# EAGLE design disp (EAGLE 7.4.0)
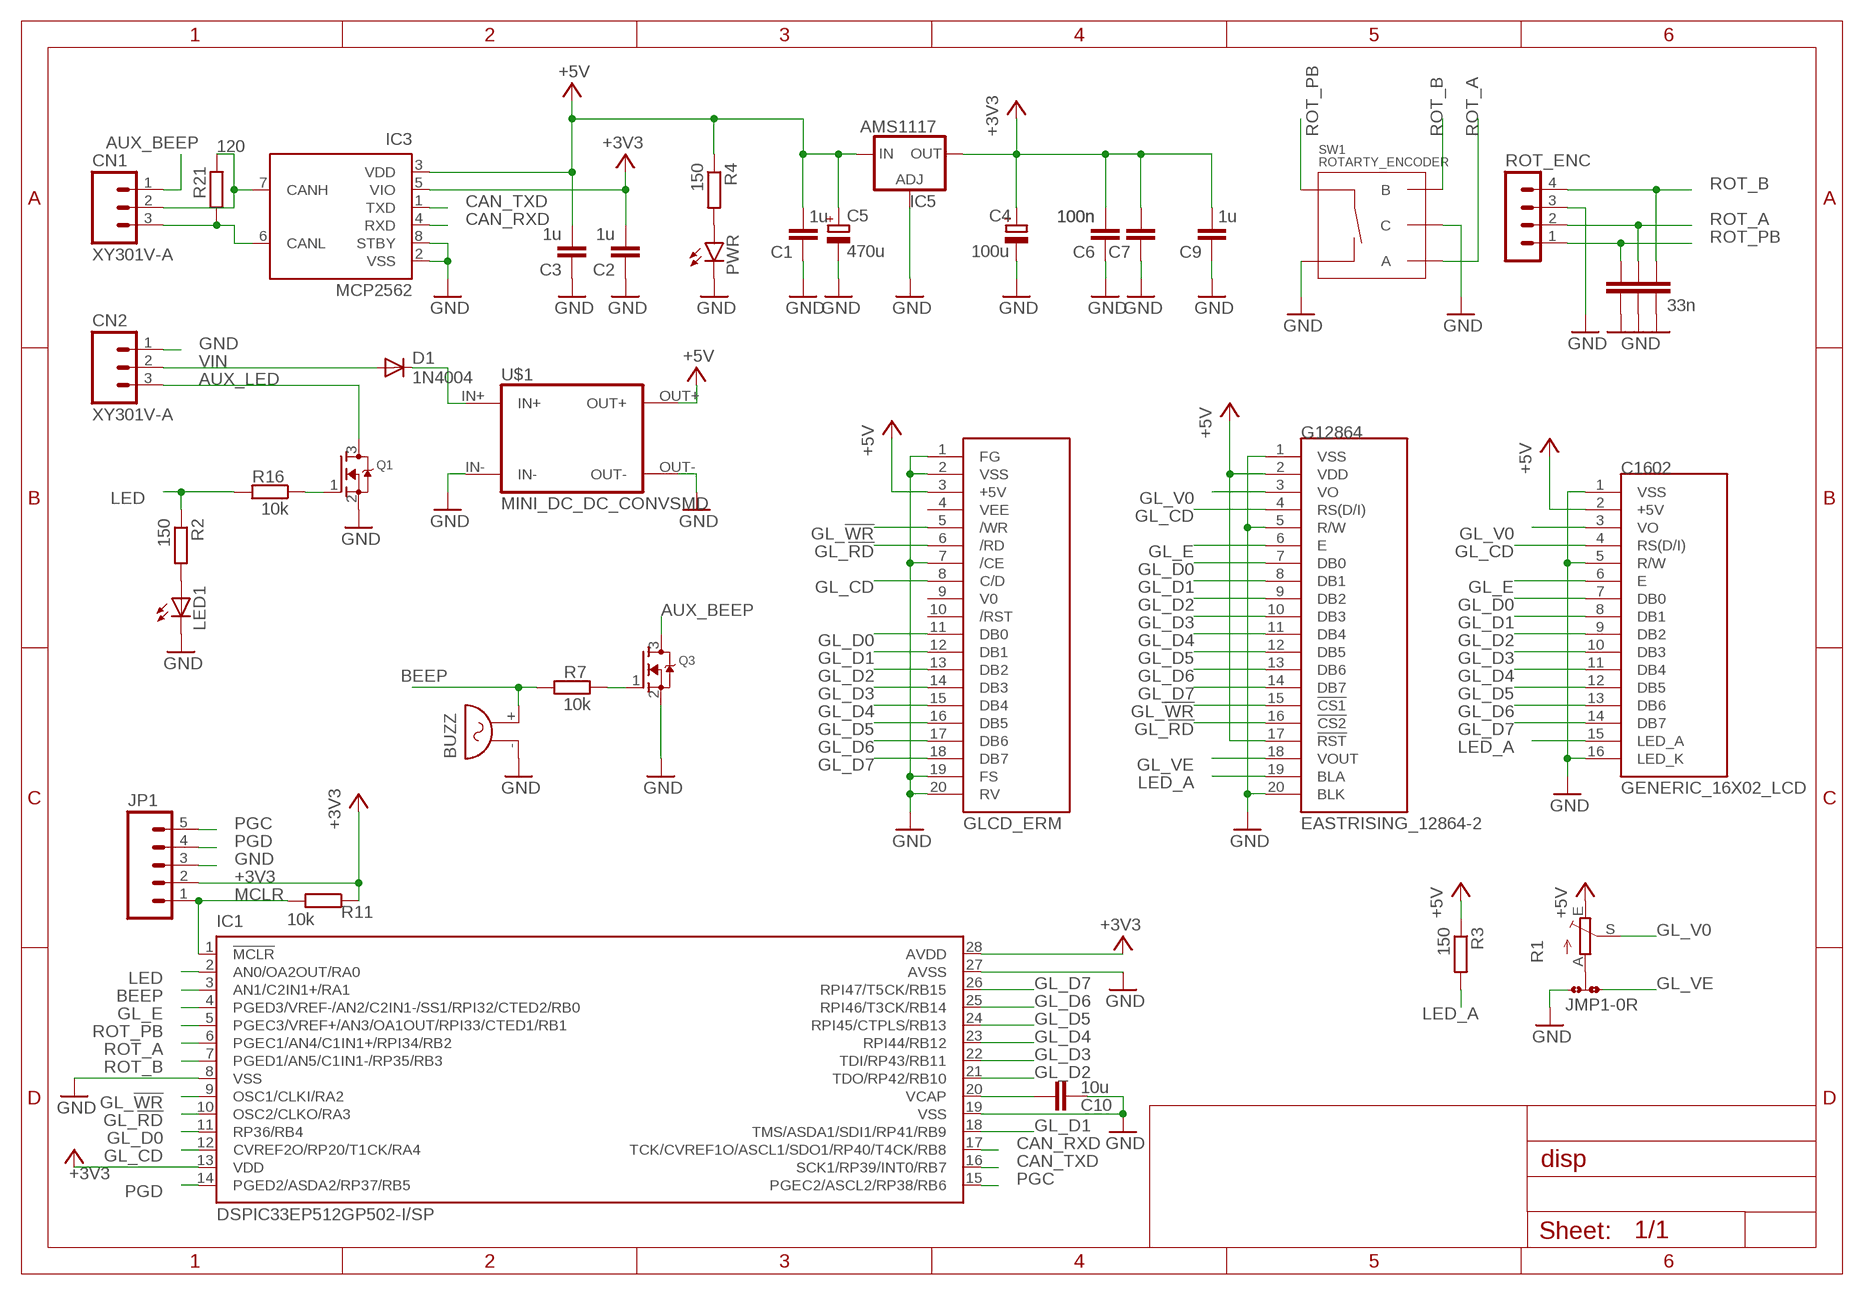
[diagram p0: schematic, sheet 1]

## Parts
BUZZ  F/QMX  [F/QMX]
C1  1u  C-EUC0603K  [C0603K]
C2  1u  C-EUC0603K  [C0603K]
C3  1u  C-EUC0603K  [C0603K]
C4  100u  CPOL-EUE2.5-7  [E2,5-7]
C5  470u  CPOL-EUE3.5-8  [E3,5-8]
C6  100n  C-EUC0603K  [C0603K]
C7  100n  C-EUC0603K  [C0603K]
C9  1u  C-EUC0603K  [C0603K]
C10  10u  C-EU025-030X050  [C025-030X050]
C11  33n  C-EUC0603K  [C0603K]
C12  33n  C-EUC0603K  [C0603K]
C13  33n  C-EUC0603K  [C0603K]
C1602  GENERIC_16X02_LCD  [1X16]
CN1  XY301V-A  [XY301V-A]
CN2  XY301V-A  [XY301V-A]
D1  1N4004  [DO41-10]
G12864  EASTRISING_12864-2  [1X20]
GLCD_ERM  WITSCHI_ERM25664AAG-1  [1X20]
IC1  DSPIC33EP512GP502-I/SP  [DIL28-3]
IC3  MCP2562  MCP2562-E/P  [DIL8]
IC5  AMS1117  LD117AS33TR  [SOT223]
JMP1  0R-JUMPB  [B0R-JMP]
JP1  M05PTH  [1X05]
LED1  LED5MM  [LED5MM]
PWR  LED-FKIT-1206  [FKIT-LED-1206]
Q1  MOSFET-NREFLOW  [SOT23]
Q3  MOSFET-NREFLOW  [SOT23]
R1  TRIM_EU-B64Y  [B64Y]
R2  150  R-EU_R0603  [R0603]
R3  150  R-EU_R0603  [R0603]
R4  150  R-EU_R0603  [R0603]
R7  10k  R-EU_R0603  [R0603]
R11  10k  R-EU_R0603  [R0603]
R16  10k  R-EU_R0603  [R0603]
R21  120  R-EU_R0603  [R0603]
ROT_ENC  MA04-1  [MA04-1]
SW1  ROTARTY_ENCODER  [ROTARY_ENC_PLAIN]
U$1  MINI_DC_DC_CONVSMD  [DSN-MINI-360-SMD]

## Nets
+3V3: C2.2 C4.+ C6.2 C7.2 C9.2 IC1.13(VDD) IC1.28(AVDD) IC3.5(VIO) IC5.2(OUT) IC5.@2(OUT) JP1.2 R11.1
+5V: C1.2 C3.2 C5.+ C1602.2(+5V) G12864.2(VDD) G12864.17(!RST) GLCD_ERM.3(+5V) IC3.3(VDD) IC5.3(IN) R1.E R3.1 R4.1 U$1.OUT+
AUX_BEEP: CN1.1 Q3.3(D)
AUX_LED: CN2.3 Q1.3(D)
BEEP: BUZZ.+ IC1.3(AN1/C2IN1+/RA1) R7.2
CAN_H: CN1.2 IC3.7(CANH) R21.2
CAN_L: CN1.3 IC3.6(CANL) R21.1
CAN_RXD: IC1.17(TCK/CVREF1O/ASCL1/SDO1/RP40/T4CK/RB8) IC3.4(RXD)
CAN_TXD: IC1.16(SCK1/RP39/INT0/RB7) IC3.1(TXD)
GL_!RD: G12864.16(!CS2) GLCD_ERM.6(/RD) IC1.10(OSC2/CLKO/RA3)
GL_!WR: G12864.15(!CS1) GLCD_ERM.5(/WR) IC1.9(OSC1/CLKI/RA2)
GL_CD: C1602.4(RS(D/I)) G12864.4(RS(D/I)) GLCD_ERM.8(C/D) IC1.12(CVREF2O/RP20/T1CK/RA4)
GL_D0: C1602.7(DB0) G12864.7(DB0) GLCD_ERM.11(DB0) IC1.11(RP36/RB4)
GL_D1: C1602.8(DB1) G12864.8(DB1) GLCD_ERM.12(DB1) IC1.18(TMS/ASDA1/SDI1/RP41/RB9)
GL_D2: C1602.9(DB2) G12864.9(DB2) GLCD_ERM.13(DB2) IC1.21(TDO/RP42/RB10)
GL_D3: C1602.10(DB3) G12864.10(DB3) GLCD_ERM.14(DB3) IC1.22(TDI/RP43/RB11)
GL_D4: C1602.11(DB4) G12864.11(DB4) GLCD_ERM.15(DB4) IC1.23(RPI44/RB12)
GL_D5: C1602.12(DB5) G12864.12(DB5) GLCD_ERM.16(DB5) IC1.24(RPI45/CTPLS/RB13)
GL_D6: C1602.13(DB6) G12864.13(DB6) GLCD_ERM.17(DB6) IC1.25(RPI46/T3CK/RB14)
GL_D7: C1602.14(DB7) G12864.14(DB7) GLCD_ERM.18(DB7) IC1.26(RPI47/T5CK/RB15)
GL_E: C1602.6(E) G12864.6(E) IC1.4(PGED3/VREF-/AN2/C2IN1-/SS1/RPI32/CTED2/RB0)
GL_V0: C1602.3(VO) G12864.3(VO) R1.S
GL_VE: G12864.18(VOUT) JMP1.3
GND: BUZZ.- C1.1 C2.1 C3.1 C4.- C5.- C6.1 C7.1 C9.1 C10.1 C11.1 C12.1 C13.1 C1602.1(VSS) C1602.5(R/W) C1602.16(LED_K) CN2.1 G12864.1(VSS) G12864.5(R/W) G12864.20(BLK) GLCD_ERM.1(FG) GLCD_ERM.2(VSS) GLCD_ERM.7(/CE) GLCD_ERM.19(FS) GLCD_ERM.20(RV) IC1.8(VSS) IC1.19(VSS) IC1.27(AVSS) IC3.2(VSS) IC3.8(STBY) IC5.1(ADJ) JMP1.1 JP1.3 LED1.K(C) PWR.C Q1.2(S) Q3.2(S) ROT_ENC.3 SW1.C SW1.SW- U$1.IN- U$1.OUT-
LED: IC1.2(AN0/OA2OUT/RA0) R2.1 R16.2
LED_A: C1602.15(LED_A) G12864.19(BLA) R3.2
MCLR: IC1.1(!MCLR!) JP1.1 R11.2
N$1: Q3.1(G) R7.1
N$2: LED1.A R2.2
N$3: PWR.A R4.2
N$5: JMP1.2 R1.A
N$9: Q1.1(G) R16.1
PGC: IC1.15(PGEC2/ASCL2/RP38/RB6) JP1.5
PGD: IC1.14(PGED2/ASDA2/RP37/RB5) JP1.4
ROT_A: C12.2 IC1.6(PGEC1/AN4/C1IN1+/RPI34/RB2) ROT_ENC.2 SW1.A
ROT_B: C13.2 IC1.7(PGED1/AN5/C1IN1-/RP35/RB3) ROT_ENC.4 SW1.B
ROT_PB: C11.2 IC1.5(PGEC3/VREF+/AN3/OA1OUT/RPI33/CTED1/RB1) ROT_ENC.1 SW1.SW+
VCAP: C10.2 IC1.20(VCAP)
VIN: CN2.2 D1.A
VIN_D: D1.C U$1.IN+
Unconnected: GLCD_ERM.10(/RST)

## Power pins joined to a net without a drawn wire
V0: GLCD_ERM.9(V0)
VEE: GLCD_ERM.4(VEE)

## Library data of the parts
BUZZ = buzzer:F/QMX: BUZZER Source: Buerklin; OC_FARNELL: unknown; OC_NEWARK: unknown
C1-C3 C6 C7 C9-C13 = rcl:C-EU: CAPACITOR, European symbol
C4 C5 = rcl:CPOL-EU: POLARIZED CAPACITOR, European symbol
C1602 = aliexpress_modules:GENERIC_16X02_LCD
CN1 CN2 = aliexpress_modules:XY301V-A: 3 Pin Screw Terminal Block Connector 5mm Pitch 5.08-301-3P 301-3P 3pin
D1 = diode:1N4004: DIODE general purpose rectifier, 1 A
G12864 = aliexpress_modules:EASTRISING_12864-2: 2.9"128x64 Graphic LCD Display Module KS0108 Black on White. http://www.buydisplay.com/default/2-9-inch-128x64-graphic-lcd-display-module-ks0108-black-on-white http://www.buydisplay.com/download/manual/ERM12864-2_Series_Datasheet.pdf
GLCD_ERM = aliexpress_modules:WITSCHI_ERM25664AAG-1: EastRising 256x64 pixel graphic LCD module Blue backlight 184x75x12 mm VR1=10k or 20k pot R18=10k C21=0.1uF Bridge from A to +C1 Bridge from K to GND_Fill
IC1 = microchip:DSPIC33EP512*502: 16-Bit Microcontrollers and Digital Signal Controllers with High-Speed PWM, Op Amps and Advanced Analog Source: ww1.microchip.com/downloads/en/DeviceDoc/70000657H.pdf
IC3 = microchip:MCP2562: High-Speed CAN Transceiver Source: http://ww1.microchip.com/downloads/en/DeviceDoc/20005167C.pdf
IC5 = v-reg:LD117A?*: Low drop fixed and adjustable positive voltage regulators 1 A Source: http://www.st.com/stonline/products/literature/ds/7194/ld1117axx.pdf
JMP1 = jump-0r-smd:0R-JUMP: SMD 0R 0805 Jumper
JP1 = SparkFun-Connectors:M05: Header 5 Standard 5-pin 0.1" header. Use with straight break away headers (SKU : PRT-00116), right angle break away headers (PRT-00553), swiss pins (PRT-00743), machine pins (PRT-00117), and female headers (PRT-00115). Molex polarized connector foot print use with SKU : PRT-08230 with associated crimp pins and housings.
LED1 = adafruit:LED: LED OSRAM: - CHIPLED LG R971, LG N971, LY N971, LG Q971, LY Q971, LO R971, LY R971 LH N974, LH R974 LS Q976, LO Q976, LY Q976 LO Q996 - Hyper CHIPLED LW Q18S LB Q993, LB Q99A, LB R99A - SideLED LS A670, LO A670, LY A670, LG A670, LP A670 LB A673, LV A673, LT A673, LW A673 LH A674 LY A675 LS A676, LA A676, LO A676, LY A676, LW A676 LS A679, LY A679, LG A679 - Hyper Micro SIDELED® LS Y876, LA Y876, LO Y876, LY Y876 LT Y87S - SmartLED LW L88C, LW L88S LB L89C, LB L89S, LG L890 LS L89K, LO L89K, LY L89K LS L896, LA L896, LO L896, LY L896 - TOPLED LS T670, LO T670, LY T670, LG T670, LP T670 LSG T670, LSP T670, LSY T670, LOP T670, LYG T670 LG T671, LOG T671, LSG T671 LB T673, LV T673, LT T673, LW T673 LH T674 LS T676, LA T676, LO T676, LY T676, LB T676, LH T676, LSB T676, LW T676 LB T67C, LV T67C, LT T67C, LS T67K, LO T67K, LY T67K, LW E67C LS E67B, LA E67B, LO E67B, LY E67B, LB E67C, LV E67C, LT E67C LW T67C LS T679, LY T679, LG T679 LS T770, LO T770, LY T770, LG T770, LP T770 LB T773, LV T773, LT T773, LW T773 LH T774 LS E675, LA E675, LY E675, LS T675 LS T776, LA T776, LO T776, LY T776, LB T776 LHGB T686 LT T68C, LB T68C - Hyper Mini TOPLED® LB M676 - Mini TOPLED Santana® LG M470 LS M47K, LO M47K, LY M47K Source: http://www.osram.convergy.de/
PWR = SparkFun-LED:LED: LEDs Standard schematic elements and footprints for 5mm, 3mm, 1206, and 0603 sized LEDs. 5mm - Spark Fun Electronics SKU : COM-00529 (and others)
Q1 Q3 = adafruit:MOSFET-N: N-Channel Mosfet 2N7002E - 60V 260mA SOT23 [Digikey: 2N7002ET1GOSTR-ND] - REEL BSH103 - 30V 850mA SOT23 [Digikey: 568-5013-1-ND]
R1 = pot:TRIM_EU-: POTENTIOMETER
R2-R4 R7 R11 R16 R21 = rcl:R-EU_: RESISTOR, European symbol
ROT_ENC = con-lstb:MA04-1: PIN HEADER; OC_FARNELL: unknown; OC_NEWARK: unknown
SW1 = SparkFun-Electromechanical:ROTARTY_ENCODER: Simple no LED rotary encoder Example: COM-09117
U$1 = aliexpress_modules:MINI_DC_DC_CONV: RC Airplane Module Mini 360 DC Buck Converter Step Down Module 4.75V-23V to 1V-17V 17x11x3.8mm New LM2596; $1.06 Input voltage: 4.75V-23V; Output voltage: 1.0V-17V; Current output: peak 3A, 1.8A long time

## Board
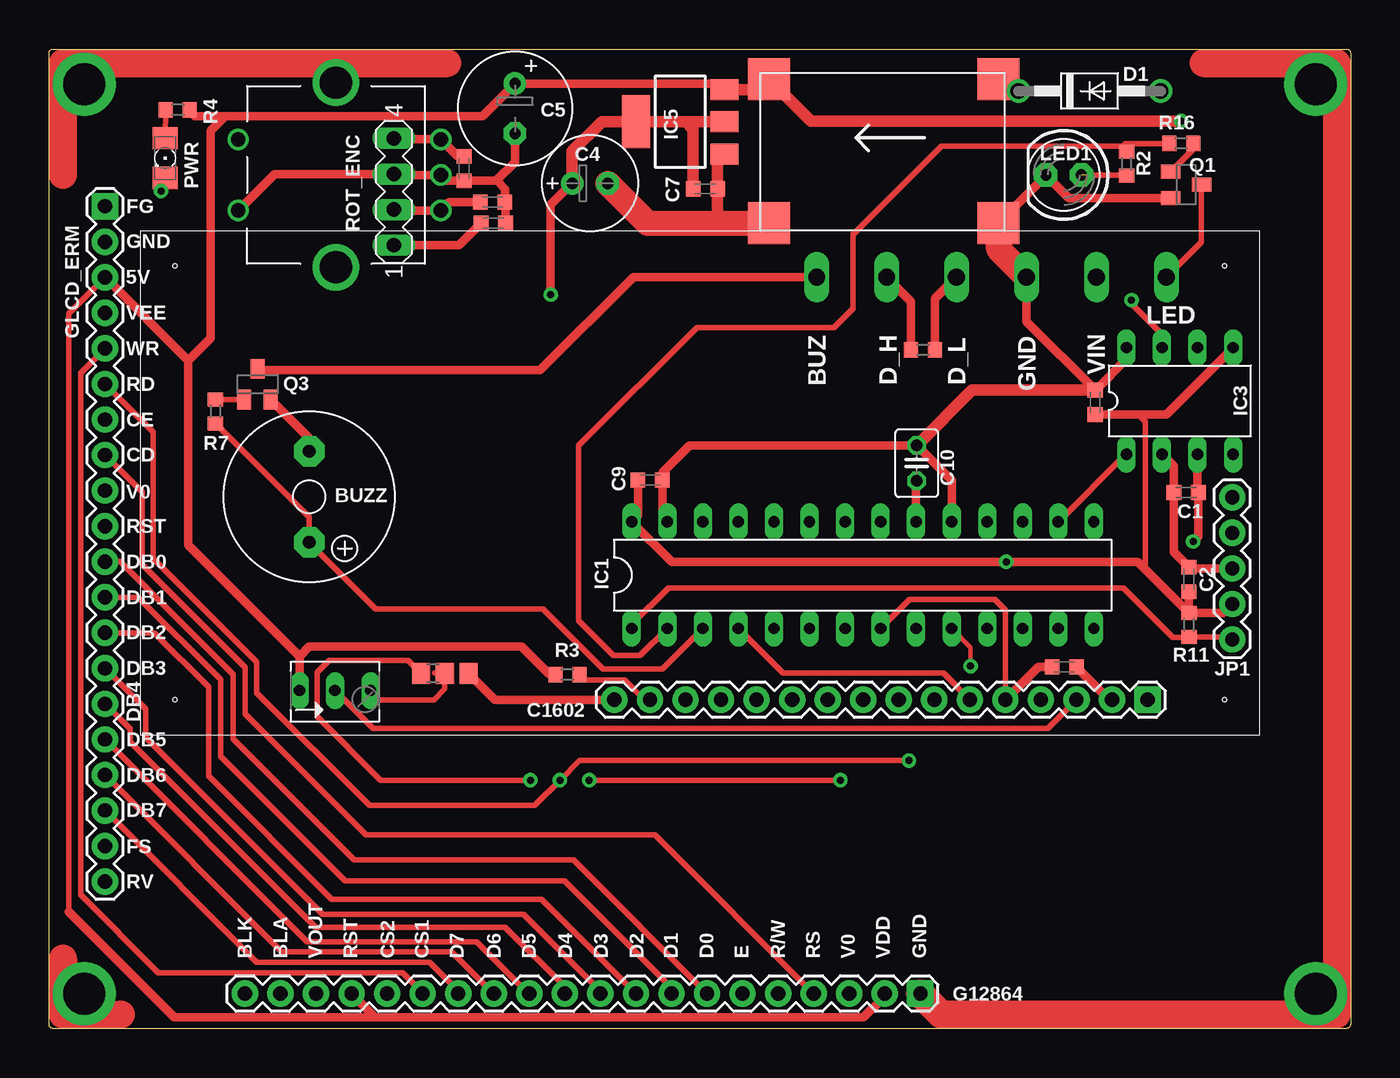
[diagram p1: board, top side]
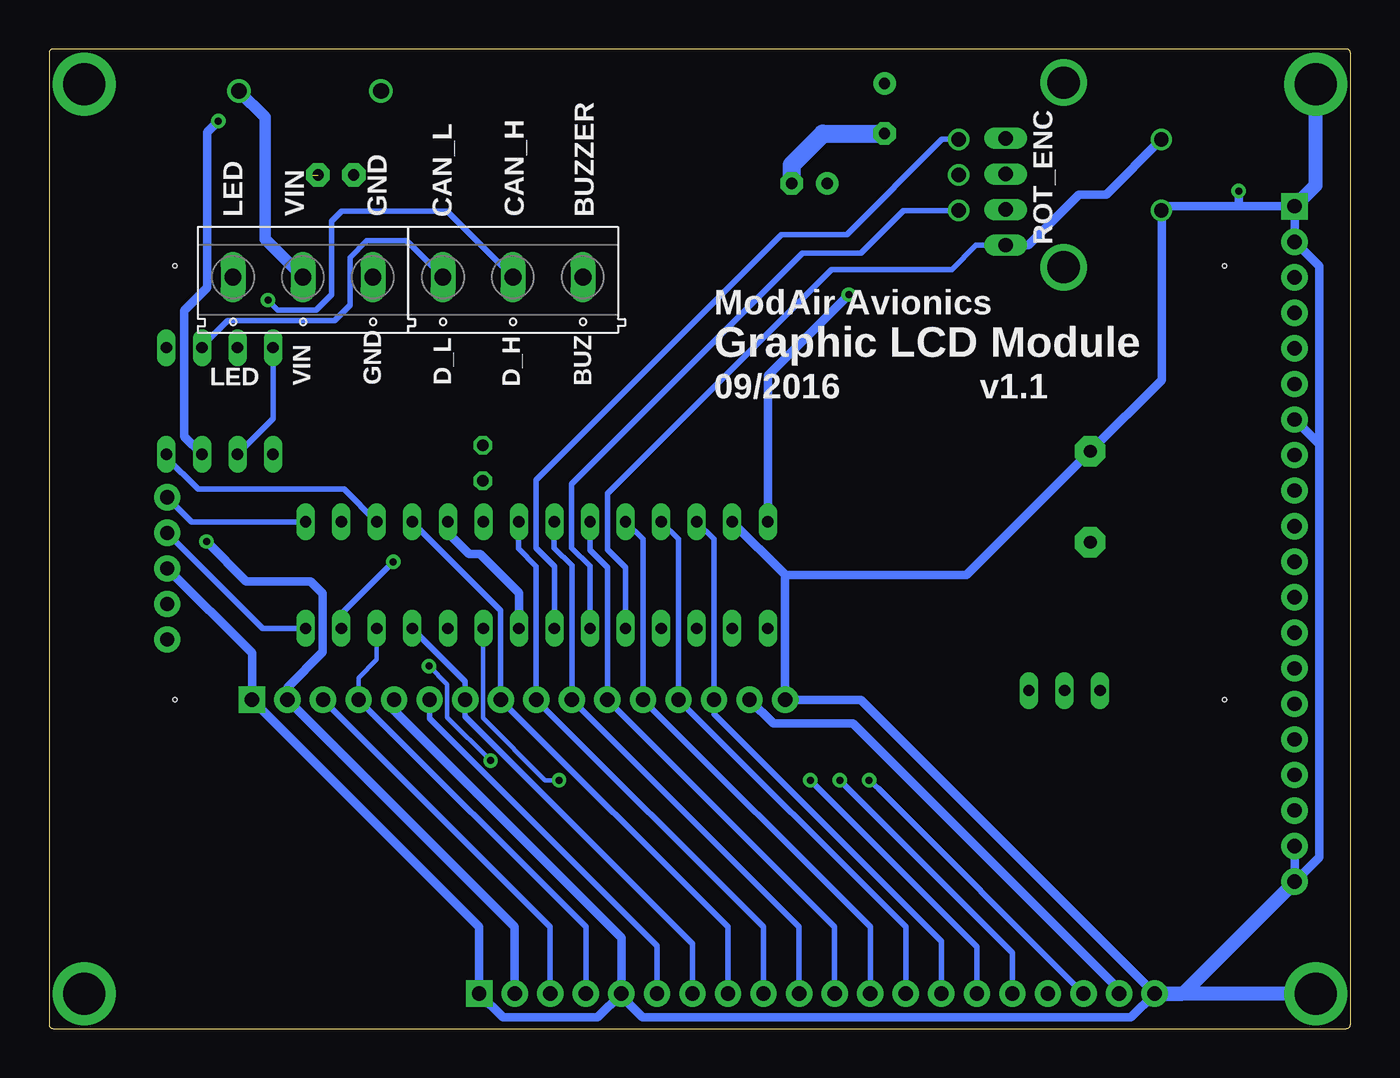
[diagram p2: board, bottom side, seen from below]

Size 93 x 70 mm. Coordinates in mm from the lower left corner, seen from the top.
Outline: 92.7,0 0.3,0 arc-90 0,0.3 0,69.7 arc-90 0.3,70 92.7,70 arc-90 93,69.7 93,0.3 arc-90 92.7,0
Copper layers (1*16): Top 0.035mm / dielectric 1.5mm / Bottom 0.035mm
Design rules "ITEAD_DRU_CHECK": minimum track width 6mil, minimum drill 12mil, track to track 6mil, track to pad 6mil, pad to pad 6mil, via to via 6mil, smd to smd 0mil, copper to edge 10mil, drill to drill 10mil, minimum pad ring 10mil, minimum via ring 6mil, stop-mask expansion 2mil, vias tented up to drill 100mil, thermal gap 10mil
Holes 0.3 mm at 9,54.5 84,54.5 84,23.5 9,23.5

### Footprints (pad centres in the part's own frame; a part is rotated, then mirrored left to right if it is on the bottom)
F/QMX = drill 0.914 pad 2.159 octagon: + 3.251,0; - -3.251,0
C0603K = smd 1.05 x 1.08: 1 -0.875,0; 2 0.875,0
E2,5-7 = drill 0.813 pad 1.6: + -1.27,0 | drill 0.813 pad 1.6 octagon: - 1.27,0
E3,5-8 = drill 0.813 pad 1.6: + -1.778,0 | drill 0.813 pad 1.6 octagon: - 1.778,0
C025-030X050 = drill 0.813 octagon: 1 -1.27,0; 2 1.27,0
1X16 = drill 1.016 pad 1.88 square: 1 0,0 | drill 1.016 pad 1.88: 2 2.54,0; 3 5.08,0; 4 7.62,0; 5 10.16,0; 6 12.7,0; 7 15.24,0; 8 17.78,0; 9 20.32,0; 10 22.86,0; 11 25.4,0; 12 27.94,0; 13 30.48,0; 14 33.02,0; 15 35.56,0; 16 38.1,0
XY301V-A = drill 1.2 long: 1 -5,0; 2 0,0; 3 5,0
DO41-10 = drill 1.118: A 5.08,0; C -5.08,0
1X20 = drill 1.016 pad 1.88 square: 1 0,0 | drill 1.016 pad 1.88: 2 2.54,0; 3 5.08,0; 4 7.62,0; 5 10.16,0; 6 12.7,0; 7 15.24,0; 8 17.78,0; 9 20.32,0; 10 22.86,0; 11 25.4,0; 12 27.94,0; 13 30.48,0; 14 33.02,0; 15 35.56,0; 16 38.1,0; 17 40.64,0; 18 43.18,0; 19 45.72,0; 20 48.26,0
DIL28-3 = drill 0.813 long: 1 -16.51,-3.81; 2 -13.97,-3.81; 3 -11.43,-3.81; 4 -8.89,-3.81; 5 -6.35,-3.81; 6 -3.81,-3.81; 7 -1.27,-3.81; 8 1.27,-3.81; 9 3.81,-3.81; 10 6.35,-3.81; 11 8.89,-3.81; 12 11.43,-3.81; 13 13.97,-3.81; 14 16.51,-3.81; 15 16.51,3.81; 16 13.97,3.81; 17 11.43,3.81; 18 8.89,3.81; 19 6.35,3.81; 20 3.81,3.81; 21 1.27,3.81; 22 -1.27,3.81; 23 -3.81,3.81; 24 -6.35,3.81; 25 -8.89,3.81; 26 -11.43,3.81; 27 -13.97,3.81; 28 -16.51,3.81
DIL8 = drill 0.813 long: 1 -3.81,-3.81; 2 -1.27,-3.81; 3 1.27,-3.81; 4 3.81,-3.81; 5 3.81,3.81; 6 1.27,3.81; 7 -1.27,3.81; 8 -3.81,3.81
SOT223 = smd 1.5 x 2: 1 -2.3,-3.15; 2 0,-3.15; 3 2.3,-3.15 | smd 3.8 x 2: @2 0,3.15
B0R-JMP = smd 1.5 x 1.3: 1 0,1.7; 2 0,0; 3 0,-1.7
1X05 = drill 1.016 pad 1.88: 1 0,0; 2 2.54,0; 3 5.08,0; 4 7.62,0; 5 10.16,0
LED5MM = drill 0.813 pad 1.676 octagon: A -1.27,0; K 1.27,0
FKIT-LED-1206 = smd 1.6 x 1.803: A -1.422,0; C 1.422,0
SOT23 = smd 1 x 1.4: 1 -0.95,-1.1; 2 0.95,-1.1; 3 0,1.1
B64Y = drill 0.813 long: A 2.54,0; E -2.54,0; S 0,0
R0603 = smd 1 x 1.1: 1 -0.85,0; 2 0.85,0
MA04-1 = drill 1.016 long: 1 -3.81,0; 2 -1.27,0; 3 1.27,0; 4 3.81,0
ROTARY_ENC_PLAIN = drill 1.016: A 7.493,-2.54; B 7.493,2.54; C 7.493,0; SW+ -6.985,2.54; SW- -6.985,-2.54 | drill 2.286: P$3 0,6.604; P$4 0,-6.604
DSN-MINI-360-SMD = smd 3 x 3: IN+ 8.3,5.2; IN- 8.3,-5.1; OUT+ -8.1,5.2; OUT- -8.1,-5.1

### Placement (x,y rotation side)
BUZZ  18.6,38 270 top
C1  81.25,38.3 0 top
C2  81.45,32.1 270 top
C3  72.55,25.85 0 top
C4  38.65,60.4 0 top
C5  33.3,65.75 270 top
C6  74.75,44.75 270 top
C7  46.9,60 180 top
C9  42.95,39.2 180 top
C10  62,40.4 270 top
C11  31.75,57.55 180 top
C12  31.7,59.05 180 top
C13  29.65,61.45 90 top
C1602  78.5,23.5 180 top
CN1  59.85,53.7 180 bottom
CN2  74.85,53.7 180 bottom
D1  74.35,67 0 top
G12864  62.26,2.5 180 top
GLCD_ERM  4,58.76 270 top
IC1  58.15,32.4 0 top
IC3  80.8,44.85 0 top
IC5  45.1,64.8 90 top
JMP1  28.28,25.39 270 top
JP1  84.55,27.8 90 top
LED1  72.5,61 180 top
PWR  8.3,62.2 270 top
Q1  81.25,60.3 270 top
Q3  14.9,46.05 0 top
R1  20.44,24.16 0 top
R2  77,61.8 270 top
R3  37.05,25.3 0 top
R4  9.2,65.65 180 top
R7  11.9,44.1 270 top
R11  81.45,28.85 270 top
R16  80.9,63.25 180 top
R21  62.45,48.5 180 top
ROT_ENC  24.65,59.8 90 top
SW1  20.5,61 0 top
U$1  59.55,62.65 0 top

### Tracks (layer width: path | path; a pad name or v marks a point on that pad's centre or on a via)
+3V3  (via drill 0.5 pad 1.02)
  Top 0.406: 78.35,32.8 78.35,43.38 77.85,43.88 | IC5.@2 41.78,64.8
  Top 0.61: JP1.2 83.91,29.7 R11.1 | C2.2 R11.1 | R11.1 78.35,32.8 77.8,33.35 v68.4,33.35 44.5,33.35 IC1.28 42.08,36.65 C9.2 | C4.+ 35.85,58.87 v35.85,52.45 | IC3.5 79.83,43.88 77.85,43.88 C6.2
  Top 0.813: IC5.2 45.5,64.8 | 45.5,64.8 IC5.@2 39.5,64.8 37.38,62.68 C4.+ | C7.2 46.02,64.28 45.5,64.8
  Bottom 0.406: v68.4,33.35 72.12,29.63 IC1.13
  Bottom 0.61: v35.85,52.45 41.64,46.66 IC1.28
+5V  (via drill 0.5 pad 1.02)
  Top 0.406: GLCD_ERM.3 1.4,51.08 1.4,8.35 | 51.4,67.9 U$1.OUT+ 50.7,67.1 | C1.2 82.05,38.38 | 47.82,67.53 IC5.3 | 12.6,65.2 12.8,65.2
  Top 0.61: G12864.17 23.32,0.8 | 23.32,0.8 58.2,0.8 59.72,2.32 G12864.2 | 1.4,8.35 8.95,0.8 23.32,0.8 | C3.2 75.78,23.5 C1602.2 | R3.1 35.75,25.3 33.75,27.3 18.6,27.3 17.9,26.6 | R1.E 17.9,26.6 | 17.9,26.6 9.95,34.55 9.95,47.73 | 9.95,47.73 GLCD_ERM.3 | C1.2 82.12,35.17 v81.75,34.8 | 82.05,38.38 82.05,41 | 47.82,67.53 C5.+ 30.97,65.2 12.8,65.2 | R4.1 10.4,65.2 12.6,65.2 11.55,64.15 11.55,49.33 9.95,47.73
  Top 0.813: IC5.3 50.7,67.1 | U$1.OUT+ 54.45,64.85 v80.9,64.85
  Bottom 0.61: G12864.2 59.72,7.26 C1602.2 75.96,24.39 73.45,26.9 73.45,31.1 74.3,31.95 78.9,31.95 v81.75,34.8 | IC3.3 83.35,42.32 83.35,51.3 81.7,52.95 81.7,64.05 v80.9,64.85
AUX_BEEP
  Top 0.406: Q3.3 15,47.05
  Top 0.61: 15,47.05 35.1,47.05 41.75,53.7 CN1.1
AUX_LED
  Top 0.406: CN2.3 82.35,56.2 Q1.3
BEEP
  Top 0.406: R7.2 18.6,36.55 BUZZ.+ 23.35,30 35.3,30 39.6,25.7 43.83,25.7 IC1.3
CAN_H  (via drill 0.5 pad 1.02)
  Top 0.406: IC3.7 79.53,49.62 77.35,51.8 v77.35,52.05
  Top 0.61: CN1.2 61.6,51.95 R21.2
  Bottom 0.406: CN1.2 64.55,58.4 72.1,58.4 72.8,57.7 72.8,52.45 73.9,51.35 76.65,51.35 v77.35,52.05
CAN_L
  Top 0.61: R21.1 63.3,52.15 CN1.3
  Bottom 0.406: CN1.3 67.45,56.3 70.3,56.3 71.5,55.1 71.5,51.7 72.6,50.6 80.25,50.6 82.07,48.78 IC3.6
CAN_RXD
  Bottom 0.406: IC3.4 84.61,40.81 82.35,38.55 71.92,38.55 IC1.17
CAN_TXD
  Top 0.406: IC3.1 76.95,41.04 IC1.16
GL_!RD  (via drill 0.5 pad 1.02)
  Top 0.305: v65.85,25.9 65.85,27.24 IC1.10
  Top 0.406: GLCD_ERM.6 7.45,42.61 7.45,33.6 14.85,26.2 14.85,24 22.9,15.95 34.7,15.95 v36.5,17.75 37.9,19.15 v61.45,19.15
  Bottom 0.305: v65.85,25.9 64.55,24.6 64.55,22.25 v61.45,19.15
  Bottom 0.406: G12864.16 24.16,5.41 v36.5,17.75
GL_!WR  (via drill 0.5 pad 1.02)
  Top 0.406: GLCD_ERM.5 2.25,46.85 2.25,9.55 7.8,4 25.25,4 26.7,2.55 G12864.15 | v38.6,17.75 v56.55,17.75
  Bottom 0.305: v56.55,17.75 57.55,17.75 62,22.2 62,28.55 IC1.9
  Bottom 0.406: v38.6,17.75 26.7,5.85 G12864.15
GL_CD
  Top 0.406: GLCD_ERM.8 6.65,38.33 6.65,33.15 14,25.8 14,22.5 22.65,13.85 43.29,13.85 G12864.4
  Bottom 0.305: IC1.12 69.58,26.37 70.88,25.07 C1602.4
  Bottom 0.406: C1602.4 54.64,7.26 G12864.4
GL_D0
  Top 0.406: G12864.7 37.47,12.05 21.8,12.05 13.15,20.7 13.15,25.3 5.09,33.36 GLCD_ERM.11
  Bottom 0.406: G12864.7 47.02,6.07 63.26,22.31 C1602.7 63.26,24.81 IC1.11
GL_D1
  Top 0.406: G12864.8 44.48,2.92 36.85,10.55 21.15,10.55 12.25,19.45 12.25,24.95 6.38,30.82 GLCD_ERM.12
  Bottom 0.406: G12864.8 44.48,7.26 C1602.8 60.72,29.89 IC1.18
GL_D2
  Top 0.406: G12864.9 35.19,9.25 20.2,9.25 11.4,18.05 11.4,24.4 7.52,28.28 GLCD_ERM.13
  Bottom 0.406: G12864.9 41.94,7.26 C1602.9 58.18,33.03 59.45,34.3 59.45,36.18 IC1.21
GL_D3
  Top 0.406: G12864.10 39.4,2.65 33.9,8.15 19.55,8.15 6.9,20.8 6.9,22.84 GLCD_ERM.14
  Bottom 0.406: G12864.10 39.4,7.26 C1602.10 55.64,33.09 56.9,34.35 56.9,36.19 IC1.22
GL_D4
  Top 0.406: G12864.11 36.86,2.99 32.6,7.25 19.05,7.25 5.8,20.5 5.8,21.4 GLCD_ERM.15
  Bottom 0.406: G12864.11 36.86,7.26 C1602.11 53.1,32.95 54.34,34.19 IC1.23
GL_D5
  Top 0.406: G12864.12 34.25,2.5 30.55,6.2 18.46,6.2 GLCD_ERM.16
  Bottom 0.406: G12864.12 34.32,7.26 C1602.12 50.56,34.97 IC1.24
GL_D6
  Top 0.406: G12864.13 28.78,5.5 16.62,5.5 GLCD_ERM.17
  Bottom 0.406: G12864.13 31.78,7.26 C1602.13 48.02,34.97 IC1.25
GL_D7
  Top 0.406: G12864.14 29.24,2.71 27.2,4.75 14.83,4.75 GLCD_ERM.18
  Bottom 0.406: IC1.26 45.48,34.97 C1602.14 45.48,22.48 29.24,6.24 G12864.14
GL_E
  Top 0.406: C1602.6 63.9,25.4 52.45,25.4 IC1.4
  Bottom 0.406: C1602.6 65.8,22.15 49.56,5.91 G12864.6
GL_V0
  Top 0.406: R1.S 23.15,21.45 71.37,21.45 C1602.3
  Bottom 0.406: C1602.3 57.18,7.26 G12864.3
GL_VE  (via drill 0.5 pad 1.02)
  Top 0.406: v34.4,17.75 23.7,17.75 19.15,22.3 19.15,25.45 20,26.3 25.67,26.3 JMP1.3
  Bottom 0.406: G12864.18 33.73,17.15 v34.4,17.75
GND  (via drill 0.5 pad 1.02, 3 pad 4.5)
  Top 0.406: C2.1 81.55,32.88 | LED1.K 71.23,60.93 | Q1.2 75.5,59.35 | 32.62,59 C12.1 32.6,59.08 | ROT_ENC.3 24.72,61 | 31.95,60.58 32.02,60.58 | IC1.8 61.48,30.65 67.6,30.65 68.34,29.91 C1602.5 | 47.77,62.02 IC5.1 | PWR.C 8,60.5 v8,59.85
  Top 0.61: 81.55,32.88 JP1.3 | C3.1 70.69,25.85 C1602.5 | IC3.2 80.38,40.2 C1.1 80.38,34.05 C2.1 | Q1.2 72.88,59.35 LED1.K | 71.23,60.93 U$1.IN- | CN2.1 69.85,50.52 C6.1 | C10.1 64.5,39.17 IC1.19 | BUZZ.- 18.6,42.2 Q3.2 | SW1.SW- 16.12,61.07 ROT_ENC.3 | 24.72,61 SW1.C 28.42,60.58 C13.1 31.95,60.58 33.3,61.92 C5.- | 32.02,60.58 32.6,60 32.6,59.08 | 32.62,59 C11.1 | JMP1.1 31.87,23.5 C1602.16 | 62,41.65 45.75,41.65 43.85,39.75 43.85,39.25 | IC3.8 76.99,47.84 74.75,45.6 | 43.85,39.25 43.85,36.54 IC1.27 | C9.1 43.83,39.23 43.85,39.25
  Top 0.813: 47.77,62.02 C7.1 47.77,57.67 47.9,57.55 | C6.1 65.95,45.62 C10.1
  Top 1: 1,1 v2.5,2.5 | 92,1 v90.5,2.5 | 92,69 v90.5,67.5 | v2.5,67.5 1,69
  Top 1.778: C4.- 42.77,57.55 47.9,57.55 U$1.OUT- | CN2.1 67.85,55.7 U$1.IN-
  Top 2: 1,5 1,1 5.15,1 | 1,61 1,69 28.45,69 | 82.5,69 92,69 92,1 63.76,1 G12864.1
  Bottom 0.406: G12864.5 52.1,2.3 | IC3.8 76.99,43.58 IC3.2 | 40.4,32.43 40.4,32.4 | 13.22,58.76 SW1.SW- | 8,58.91 8.15,58.76
  Bottom 0.61: 52.1,2.3 50.6,0.8 15.7,0.8 G12864.20 35,23.5 C1602.16 40.4,32.4 27.45,32.4 BUZZ.- 13.5,46.35 13.5,58.45 | 2.25,41.77 2.25,12.25 GLCD_ERM.20 GLCD_ERM.19 | 2.25,41.77 GLCD_ERM.7 | 2.25,41.77 2.25,54.47 GLCD_ERM.2 GLCD_ERM.1 8.15,58.76 13.22,58.76 | IC1.8 59.42,31.13 62.19,33.9 63,33.9 64.5,35.4 IC1.19 | IC1.27 40.4,32.43 | JP1.3 78.5,26.83 C1602.1 62.26,7.26 G12864.1 60.56,0.8 53.8,0.8 G12864.5 52.1,6.5 68.34,22.74 C1602.5 | v8,59.85 8,58.91
  Bottom 1: GLCD_ERM.1 2.5,60.26 v2.5,67.5 | GLCD_ERM.20 12,2.5 G12864.20 v2.5,2.5
  Bottom 1.27: C4.- 39.92,61.73 37.7,63.95 33.32,63.95 C5.-
LED
  Top 0.406: IC1.2 42.24,26.65 40.35,26.65 37.85,29.15 37.85,41.65 46.3,50.1 56.1,50.1 57.45,51.45 57.45,56.75 63.75,63.05 76.6,63.05 76.65,63 | 76.65,63 R2.1 | R16.2 76.9,63.25 76.65,63
LED_A
  Top 0.406: R3.2 38.3,24.9 41.15,24.9 42.55,23.5 C1602.15
  Bottom 0.61: C1602.15 41.24,21.8 35.55,21.8 16.54,2.79 G12864.19
MCLR
  Top 0.406: IC1.1 41.64,28.89 44.25,31.5 76.75,31.5 80.3,27.95 81.4,27.95 R11.2 84.35,28 JP1.1
N$1
  Top 0.406: R7.1 Q3.1
N$2  (1 unrouted)
  Top 0.406: 74.15,61 76.95,61 R2.2
N$3
  Top 0.406: PWR.A R4.2
N$5
  Top 0.406: R1.A 23.64,23.5 27.5,23.5 28.28,24.28 28.3,25.4 | 28.19,25.39 JMP1.2 28.3,25.4 | 27.55,25.4 28.3,25.4
N$9
  Top 0.406: R16.1 81.75,62.85 Q1.1
PGC
  Bottom 0.406: JP1.5 82.8,36.21 IC1.15
PGD
  Bottom 0.406: JP1.4 77.72,28.59 IC1.14
ROT_A
  Top 0.61: C12.2 28.58,59.05 SW1.A 24.72,58.46 ROT_ENC.2
  Bottom 0.406: IC1.6 54.34,33.04 55.65,34.35 55.65,38.9 39.15,55.4 35,55.4 31.94,58.46 SW1.A
ROT_B
  Top 0.61: ROT_ENC.4 24.72,63.54 SW1.B 29.21,62.33 C13.2
  Bottom 0.406: IC1.7 56.88,33.03 58.2,34.35 58.2,39.2 40.65,56.75 36,56.75 29.21,63.54 SW1.B
ROT_PB
  Top 0.61: C11.2 29.32,55.99 ROT_ENC.1
  Bottom 0.406: IC1.5 51.8,32.95 53.1,34.25 53.1,38.25 37.1,54.25 28.5,54.25 26.76,55.99 ROT_ENC.1
  Bottom 0.61: ROT_ENC.1 23.01,55.99 19.4,59.6 17.45,59.6 SW1.SW+
VCAP
  Top 0.61: IC1.20 61.96,39.09 C10.2
VIN
  Bottom 0.813: CN2.2 77.55,56.4 77.55,65.12 D1.A
VIN_D
  Top 0.813: D1.C 68.7,67 U$1.IN+

### Text on the board
tPlace: FG | GND | 5V | VEE | BUZ | VIN | LED | GND | WR | RD | D_H | D_L | CE | CD | V0 | RST | DB0 | DB1 | DB2 | DB3 | DB4 | DB5 | DB6 | DB7 | FS | RV | BLK | BLA | VOUT | RST | CS2 | CS1 | D7 | D6 | D5 | D4 | D3 | D2 | D1 | D0 | E | R/W | RS | V0 | VDD | GND
bPlace: ROT_ENC | BUZZER | CAN_H | CAN_L | GND | VIN | LED | ModAir Avionics | BUZ | D_H | Graphic LCD Module | D_L | GND | VIN | LED | v1.1 | 09/2016